# EAGLE design Cartridge_Board_v0.1 (EAGLE 8.3.2)
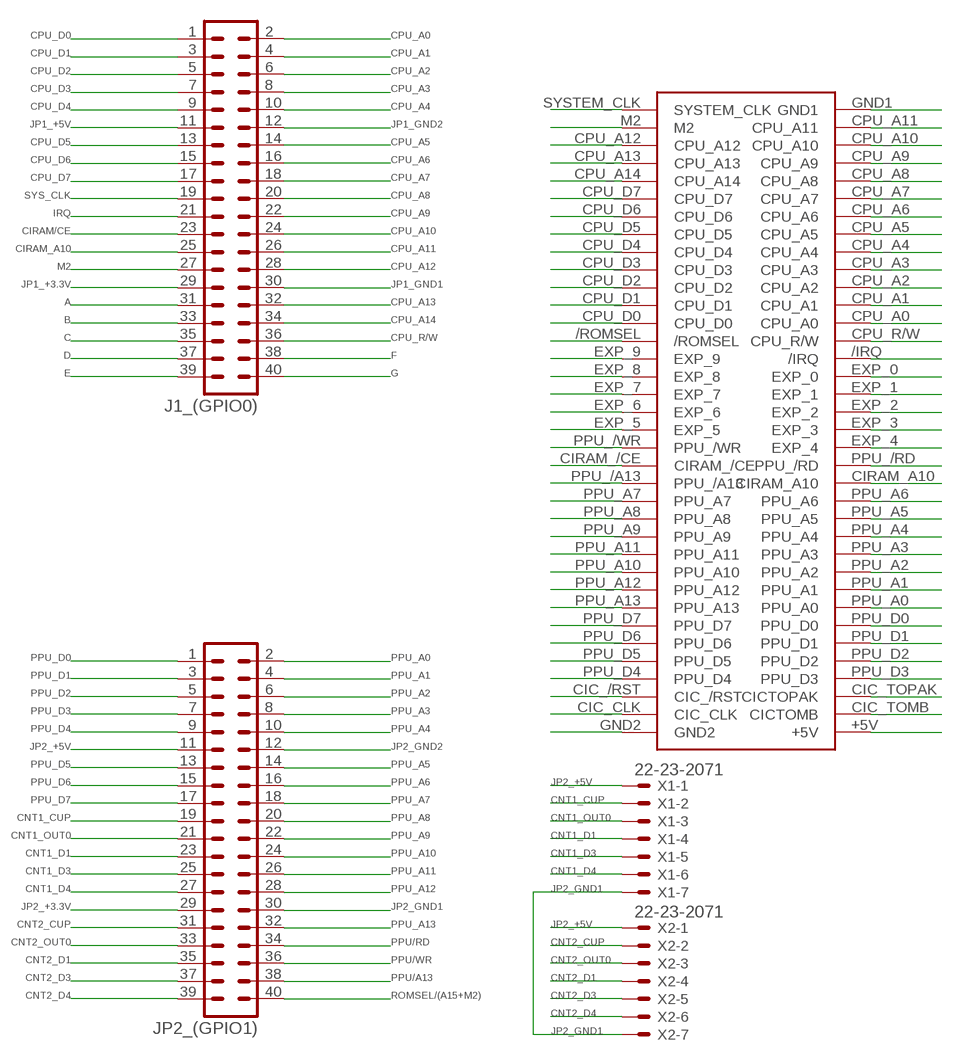
[diagram p0: schematic, sheet 1]

## Parts
J1_(GPIO0)  40V  [40V]
JP2_(GPIO1)  40V  [40V]
U$1  CONNFEMALE72PIN0.1  [36X2]
X1  22-23-2071  [22-23-2071]
X2  22-23-2071  [22-23-2071]

## Nets
A: J1_(GPIO0).31
B: J1_(GPIO0).33
C: J1_(GPIO0).35
CIRAM/CE: J1_(GPIO0).23 U$1.CIRAM_/CE
CIRAM_A10: J1_(GPIO0).25 U$1.CIRAM_A10
CNT1_CUP: JP2_(GPIO1).19 X1.2
CNT1_D1: JP2_(GPIO1).23 X1.4
CNT1_D3: JP2_(GPIO1).25 X1.5
CNT1_D4: JP2_(GPIO1).27 X1.6
CNT1_OUT0: JP2_(GPIO1).21 X1.3
CNT2_CUP: JP2_(GPIO1).31 X2.2
CNT2_D1: JP2_(GPIO1).35 X2.4
CNT2_D3: JP2_(GPIO1).37 X2.5
CNT2_D4: JP2_(GPIO1).39 X2.6
CNT2_OUT0: JP2_(GPIO1).33 X2.3
CPU_A0: J1_(GPIO0).2 U$1.CPU_A0
CPU_A1: J1_(GPIO0).4 U$1.CPU_A1
CPU_A2: J1_(GPIO0).6 U$1.CPU_A2
CPU_A3: J1_(GPIO0).8 U$1.CPU_A3
CPU_A4: J1_(GPIO0).10 U$1.CPU_A4
CPU_A5: J1_(GPIO0).14 U$1.CPU_A5
CPU_A6: J1_(GPIO0).16 U$1.CPU_A6
CPU_A7: J1_(GPIO0).18 U$1.CPU_A7
CPU_A8: J1_(GPIO0).20 U$1.CPU_A8
CPU_A9: J1_(GPIO0).22 U$1.CPU_A9
CPU_A10: J1_(GPIO0).24 U$1.CPU_A10
CPU_A11: J1_(GPIO0).26 U$1.CPU_A11
CPU_A12: J1_(GPIO0).28 U$1.CPU_A12
CPU_A13: J1_(GPIO0).32 U$1.CPU_A13
CPU_A14: J1_(GPIO0).34 U$1.CPU_A14
CPU_D0: J1_(GPIO0).1 U$1.CPU_D0
CPU_D1: J1_(GPIO0).3 U$1.CPU_D1
CPU_D2: J1_(GPIO0).5 U$1.CPU_D2
CPU_D3: J1_(GPIO0).7 U$1.CPU_D3
CPU_D4: J1_(GPIO0).9 U$1.CPU_D4
CPU_D5: J1_(GPIO0).13 U$1.CPU_D5
CPU_D6: J1_(GPIO0).15 U$1.CPU_D6
CPU_D7: J1_(GPIO0).17 U$1.CPU_D7
CPU_R/W: J1_(GPIO0).36 U$1.CPU_R/W
D: J1_(GPIO0).37
E: J1_(GPIO0).39
F: J1_(GPIO0).38
G: J1_(GPIO0).40
IRQ: J1_(GPIO0).21 U$1./IRQ
JP1_+3.3V: J1_(GPIO0).29
JP1_+5V: J1_(GPIO0).11
JP1_GND1: J1_(GPIO0).30 U$1.GND1 U$1.GND2
JP1_GND2: J1_(GPIO0).12
JP2_+3.3V: JP2_(GPIO1).29
JP2_+5V: JP2_(GPIO1).11 U$1.+5V X1.1 X2.1
JP2_GND1: JP2_(GPIO1).30 X1.7 X2.7
JP2_GND2: JP2_(GPIO1).12
M2: J1_(GPIO0).27 U$1.M2
N$27: U$1.EXP_9
N$28: U$1.EXP_8
N$29: U$1.EXP_7
N$30: U$1.EXP_6
N$31: U$1.EXP_5
N$47: U$1.CIC_/RST
N$48: U$1.CIC_CLK
N$65: U$1.EXP_0
N$66: U$1.EXP_1
N$67: U$1.EXP_2
N$68: U$1.EXP_3
N$69: U$1.EXP_4
N$83: U$1.CIC_TOPAK(CICTOPAK)
N$84: U$1.CIC_TOMB(CICTOMB)
PPU/A13: JP2_(GPIO1).38 U$1.PPU_/A13
PPU/RD: JP2_(GPIO1).34 U$1.PPU_/RD
PPU/WR: JP2_(GPIO1).36 U$1.PPU_/WR
PPU_A0: JP2_(GPIO1).2 U$1.PPU_A0
PPU_A1: JP2_(GPIO1).4 U$1.PPU_A1
PPU_A2: JP2_(GPIO1).6 U$1.PPU_A2
PPU_A3: JP2_(GPIO1).8 U$1.PPU_A3
PPU_A4: JP2_(GPIO1).10 U$1.PPU_A4
PPU_A5: JP2_(GPIO1).14 U$1.PPU_A5
PPU_A6: JP2_(GPIO1).16 U$1.PPU_A6
PPU_A7: JP2_(GPIO1).18 U$1.PPU_A7
PPU_A8: JP2_(GPIO1).20 U$1.PPU_A8
PPU_A9: JP2_(GPIO1).22 U$1.PPU_A9
PPU_A10: JP2_(GPIO1).24 U$1.PPU_A10
PPU_A11: JP2_(GPIO1).26 U$1.PPU_A11
PPU_A12: JP2_(GPIO1).28 U$1.PPU_A12
PPU_A13: JP2_(GPIO1).32 U$1.PPU_A13
PPU_D0: JP2_(GPIO1).1 U$1.PPU_D0
PPU_D1: JP2_(GPIO1).3 U$1.PPU_D1
PPU_D2: JP2_(GPIO1).5 U$1.PPU_D2
PPU_D3: JP2_(GPIO1).7 U$1.PPU_D3
PPU_D4: JP2_(GPIO1).9 U$1.PPU_D4
PPU_D5: JP2_(GPIO1).13 U$1.PPU_D5
PPU_D6: JP2_(GPIO1).15 U$1.PPU_D6
PPU_D7: JP2_(GPIO1).17 U$1.PPU_D7
ROMSEL/(A15+M2): JP2_(GPIO1).40 U$1./ROMSEL
SYS_CLK: J1_(GPIO0).19 U$1.SYSTEM_CLK

## Library data of the parts
J1_(GPIO0) JP2_(GPIO1) = con-harting-v:40V: CONNECTOR; OC_FARNELL: unknown; OC_NEWARK: unknown
U$1 = NES:CONNFEMALE72PIN0.1
X1 X2 = con-molex:22-23-2071: .100" (2.54mm) Center Header - 7 Pin; MF: MOLEX; MPN: 22-23-2071; OC_FARNELL: 1654534; OC_NEWARK: 56H0445

## Board
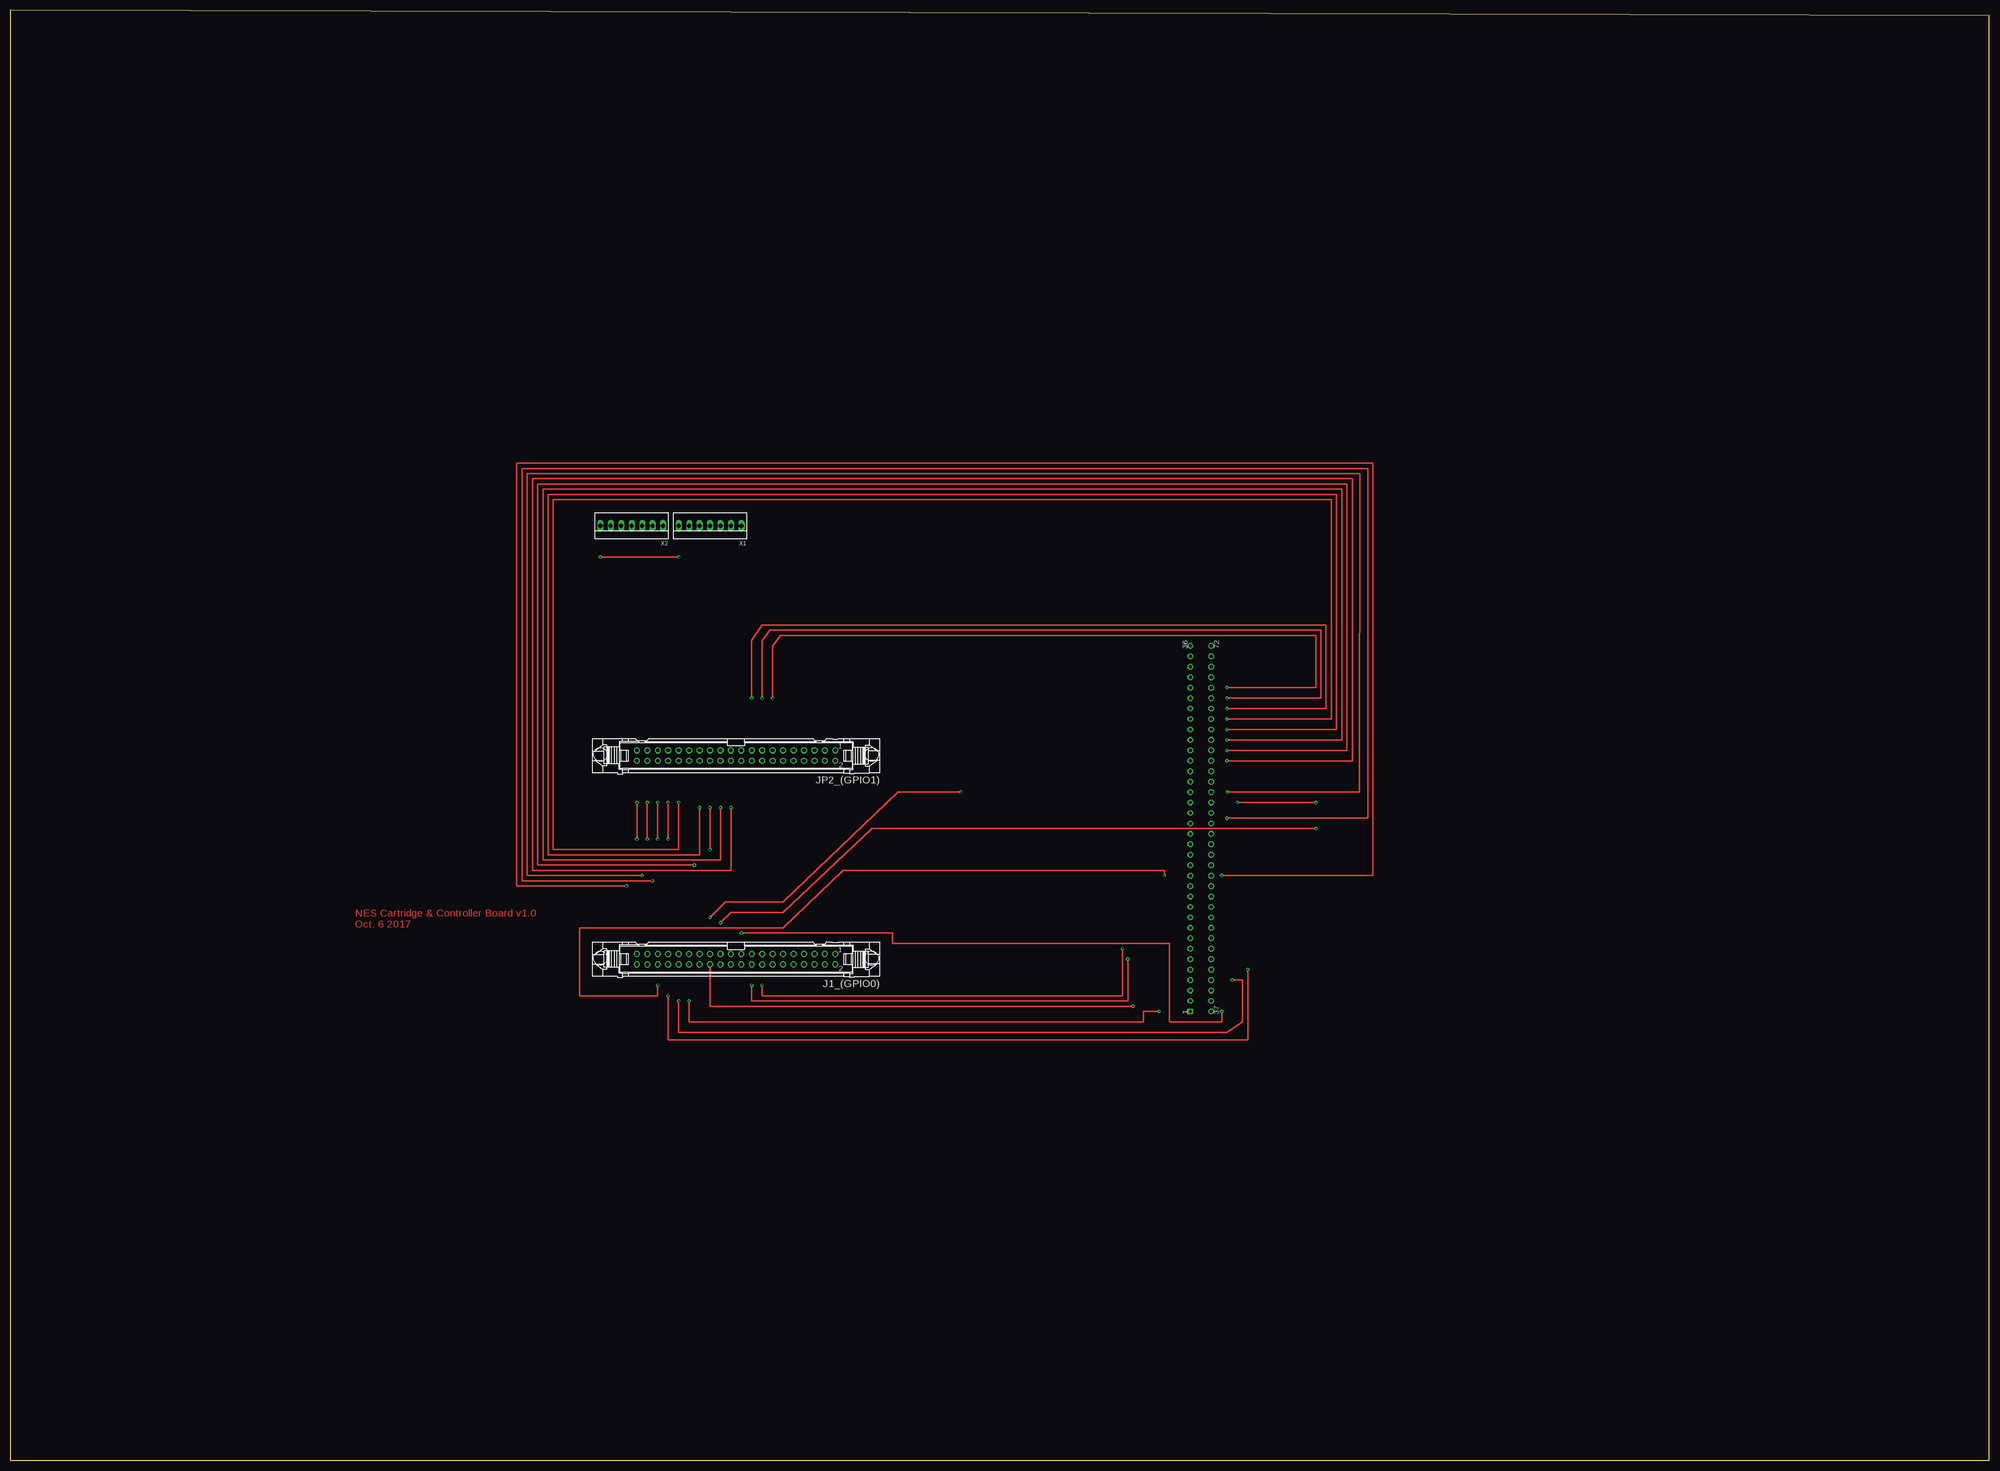
[diagram p1: board, top side]
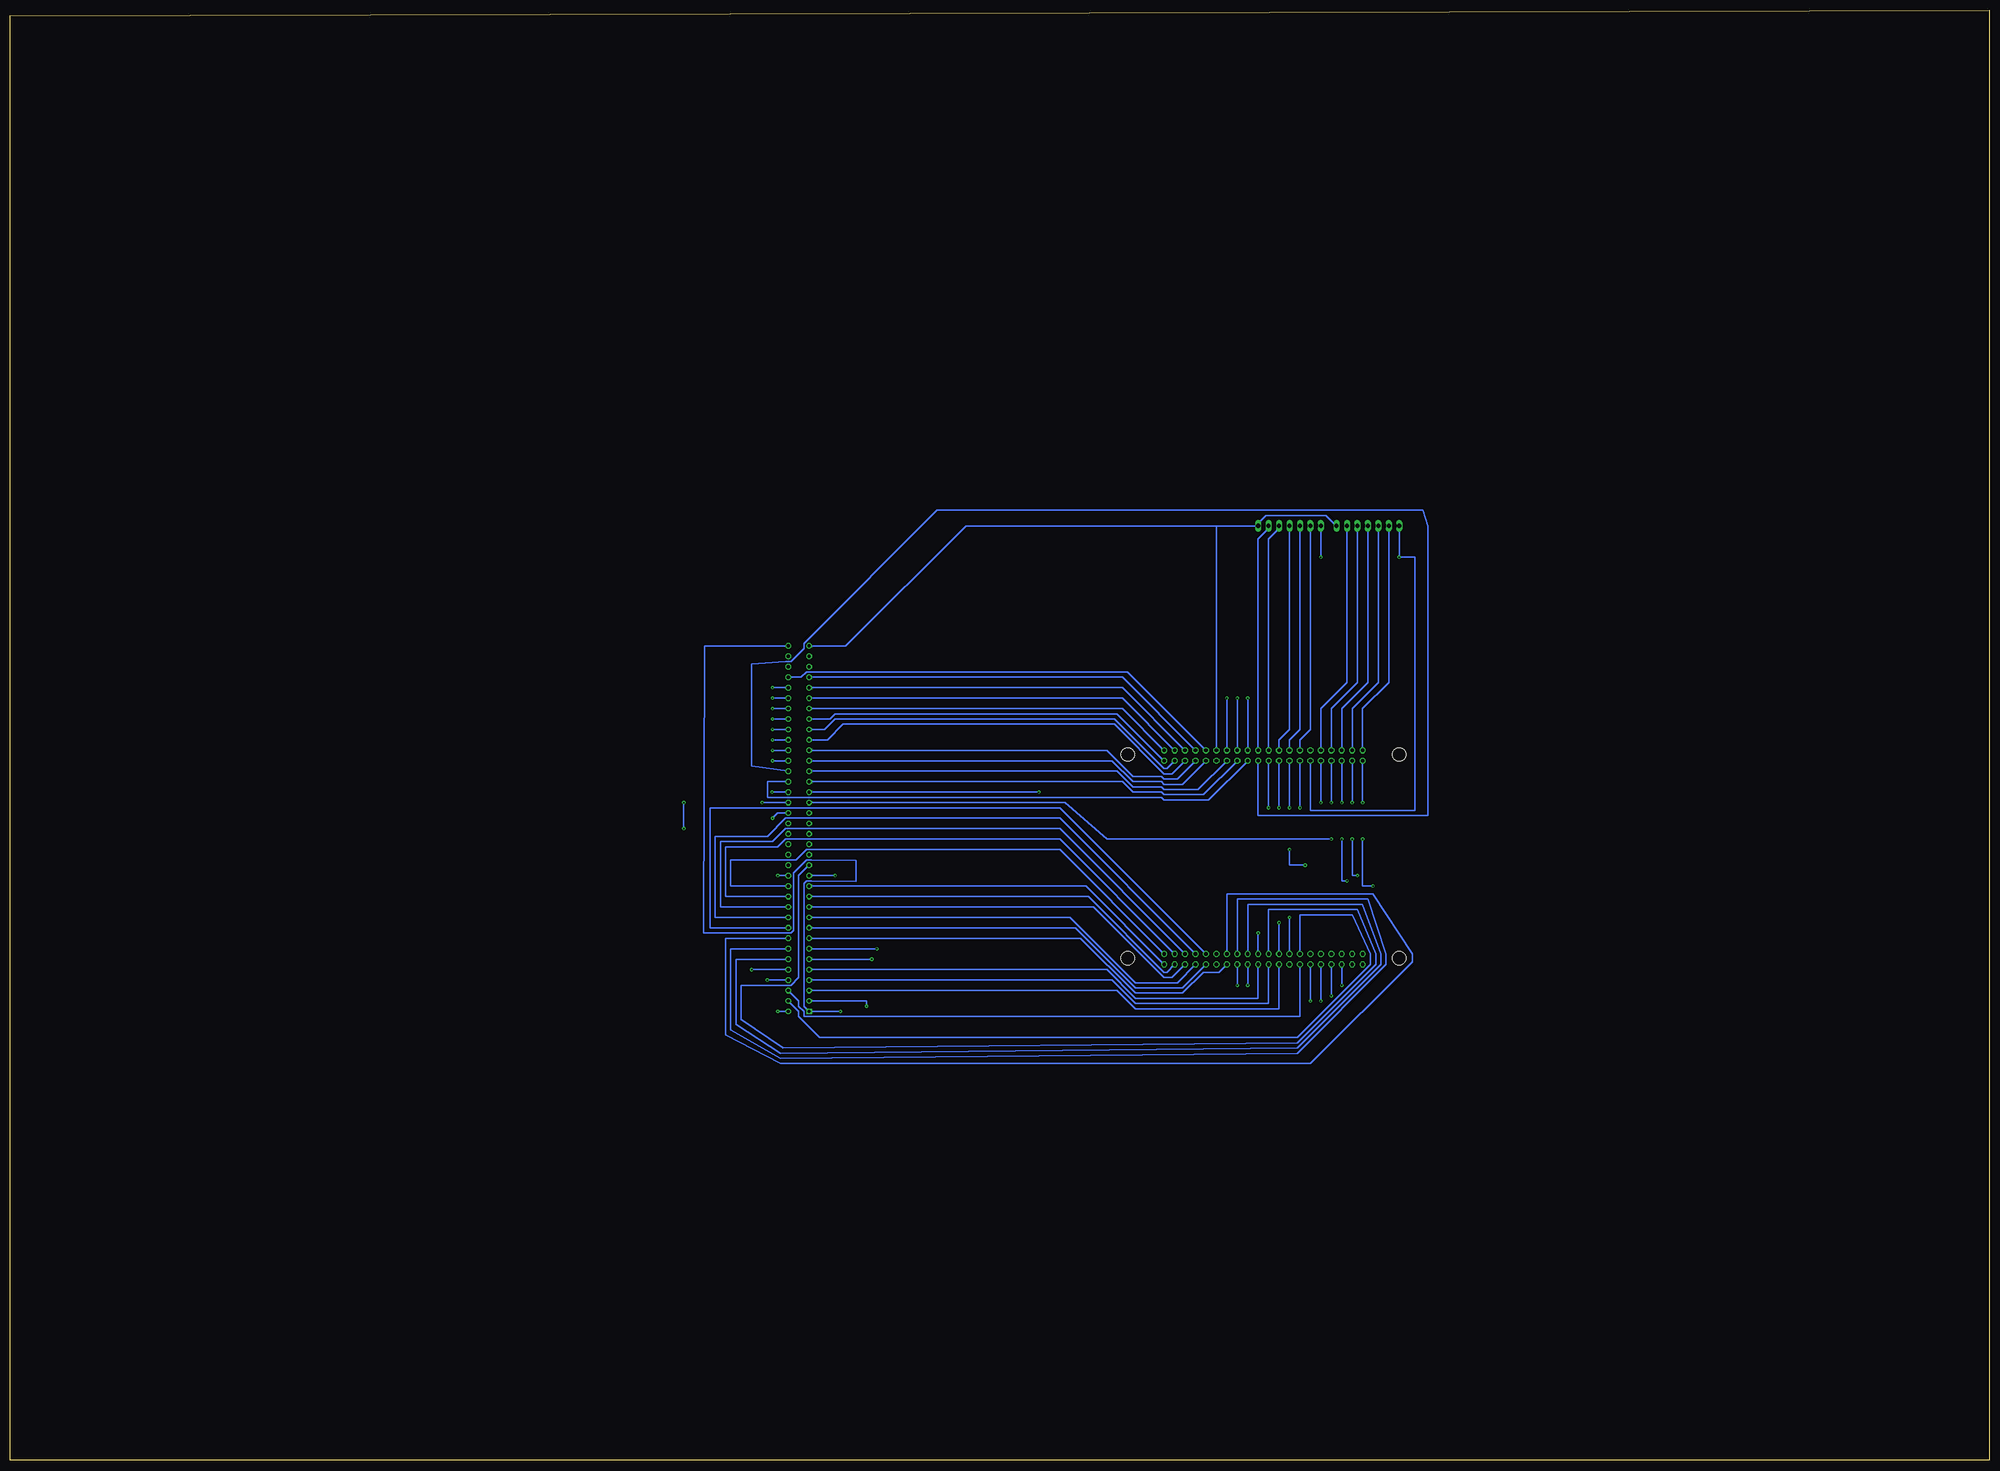
[diagram p2: board, bottom side, seen from below]

Size 481.31 x 352.73 mm. Coordinates in mm from the lower left corner, seen from the top.
Outline: 0,0 481.31,0 481.31,351.46 0,352.73 0,0
Copper layers (1*16): Top 0.035mm / dielectric 1.5mm / Bottom 0.035mm
Design rules "default *": minimum track width 16mil, minimum drill 0.35mm, track to track 16mil, track to pad 16mil, pad to pad 16mil, via to via 16mil, smd to smd 16mil, copper to edge 40mil, drill to drill 6mil, minimum pad ring 10mil, minimum via ring 8mil, stop-mask expansion 4mil, vias tented up to drill 0mil, thermal gap 10mil

### Footprints (pad centres in the part's own frame; a part is rotated, then mirrored left to right if it is on the bottom)
40V = drill 0.914: 1 -24.13,-1.27 | drill 0.914 octagon: 2 -24.13,1.27; 3 -21.59,-1.27; 4 -21.59,1.27; 5 -19.05,-1.27; 6 -19.05,1.27; 7 -16.51,-1.27; 8 -16.51,1.27; 9 -13.97,-1.27; 10 -13.97,1.27; 11 -11.43,-1.27; 12 -11.43,1.27; 13 -8.89,-1.27; 14 -8.89,1.27; 15 -6.35,-1.27; 16 -6.35,1.27; 17 -3.81,-1.27; 18 -3.81,1.27; 19 -1.27,-1.27; 20 -1.27,1.27; 21 1.27,-1.27; 22 1.27,1.27; 23 3.81,-1.27; 24 3.81,1.27; 25 6.35,-1.27; 26 6.35,1.27; 27 8.89,-1.27; 28 8.89,1.27; 29 11.43,-1.27; 30 11.43,1.27; 31 13.97,-1.27; 32 13.97,1.27; 33 16.51,-1.27; 34 16.51,1.27; 35 19.05,-1.27; 36 19.05,1.27; 37 21.59,-1.27; 38 21.59,1.27; 39 24.13,-1.27; 40 24.13,1.27 | hole 3.302: 33.02,-0.254; -33.02,-0.254
36X2 = drill 0.8 octagon: +5V 44.45,2.54; /IRQ -8.89,2.54; /ROMSEL -11.43,-2.54; CIC_/RST 39.37,-2.54; CIC_CLK 41.91,-2.54; CIC_TOMB 41.91,2.54; CIC_TOPAK 39.37,2.54; CIRAM_/CE 6.35,-2.54; CIRAM_A10 8.89,2.54; CPU_A0 -13.97,2.54; CPU_A1 -16.51,2.54; CPU_A2 -19.05,2.54; CPU_A3 -21.59,2.54; CPU_A4 -24.13,2.54; CPU_A5 -26.67,2.54; CPU_A6 -29.21,2.54; CPU_A7 -31.75,2.54; CPU_A8 -34.29,2.54; CPU_A9 -36.83,2.54; CPU_A10 -39.37,2.54; CPU_A11 -41.91,2.54; CPU_A12 -39.37,-2.54; CPU_A13 -36.83,-2.54; CPU_A14 -34.29,-2.54; CPU_D0 -13.97,-2.54; CPU_D1 -16.51,-2.54; CPU_D2 -19.05,-2.54; CPU_D3 -21.59,-2.54; CPU_D4 -24.13,-2.54; CPU_D5 -26.67,-2.54; CPU_D6 -29.21,-2.54; CPU_D7 -31.75,-2.54; CPU_R/W -11.43,2.54; EXP_0 -6.35,2.54; EXP_1 -3.81,2.54; EXP_2 -1.27,2.54; EXP_3 1.27,2.54; EXP_4 3.81,2.54; EXP_5 1.27,-2.54; EXP_6 -1.27,-2.54; EXP_7 -3.81,-2.54; EXP_8 -6.35,-2.54; EXP_9 -8.89,-2.54; GND2 44.45,-2.54; M2 -41.91,-2.54; PPU_/A13 8.89,-2.54; PPU_/RD 6.35,2.54; PPU_/WR 3.81,-2.54; PPU_A0 26.67,2.54; PPU_A1 24.13,2.54; PPU_A2 21.59,2.54; PPU_A3 19.05,2.54; PPU_A4 16.51,2.54; PPU_A5 13.97,2.54; PPU_A6 11.43,2.54; PPU_A7 11.43,-2.54; PPU_A8 13.97,-2.54; PPU_A9 16.51,-2.54; PPU_A10 21.59,-2.54; PPU_A11 19.05,-2.54; PPU_A12 24.13,-2.54; PPU_A13 26.67,-2.54; PPU_D0 29.21,2.54; PPU_D1 31.75,2.54; PPU_D2 34.29,2.54; PPU_D3 36.83,2.54; PPU_D4 36.83,-2.54; PPU_D5 34.29,-2.54; PPU_D6 31.75,-2.54; PPU_D7 29.21,-2.54; SYSTEM_CLK -44.45,-2.54 | drill 0.8 square: GND1 -44.45,2.54
22-23-2071 = drill 1 long: 1 -7.62,0; 2 -5.08,0; 3 -2.54,0; 4 0,0; 5 2.54,0; 6 5.08,0; 7 7.62,0

### Placement (x,y rotation side)
DRILEGEND  [DRILEGEND]  0,-3.81 0 top  (outside the outline)
J1_(GPIO0)  176.53,121.92 180 top
JP2_(GPIO1)  176.53,171.45 180 top
U$1  289.56,153.67 90 top
X1  170.18,227.33 180 top
X2  151.13,227.33 180 top

### Tracks (layer width: path | path; a pad name or v marks a point on that pad's centre or on a via)
CIRAM/CE  (via drill 0.35)
  Top 0.406: v298.45,160.02 v317.5,160.02 | v317.5,153.67 209.55,153.67 187.96,133.35 175.26,133.35 v172.72,130.81
  Bottom 0.406: U$1.CIRAM_/CE v298.45,160.02 | v317.5,160.02 v317.5,153.67 | v172.72,130.81 J1_(GPIO0).23
CIRAM_A10  (via drill 0.35)
  Top 0.406: v231.14,162.56 215.9,162.56 187.96,135.89 173.99,135.89 v170.18,132.08
  Bottom 0.406: U$1.CIRAM_A10 v231.14,162.56 | v170.18,132.08 J1_(GPIO0).25
CNT1_CUP
  Bottom 0.406: JP2_(GPIO1).19 177.8,224.15 175.26,226.69 X1.2
CNT1_D1
  Bottom 0.406: JP2_(GPIO1).23 172.72,175.26 170.18,177.8 X1.4
CNT1_D3
  Bottom 0.406: JP2_(GPIO1).25 170.18,175.26 167.64,177.8 X1.5
CNT1_D4
  Bottom 0.406: JP2_(GPIO1).27 167.64,175.26 165.1,177.8 X1.6
CNT1_OUT0
  Bottom 0.406: JP2_(GPIO1).21 175.26,224.15 172.72,226.69 X1.3
CNT2_CUP
  Bottom 0.406: X2.2 156.21,189.23 162.56,182.88 JP2_(GPIO1).31
CNT2_D1
  Bottom 0.406: X2.4 151.13,189.23 157.48,182.88 JP2_(GPIO1).35
CNT2_D3
  Bottom 0.406: X2.5 148.59,189.23 154.94,182.88 JP2_(GPIO1).37
CNT2_D4
  Bottom 0.406: X2.6 146.05,189.23 152.4,182.88 JP2_(GPIO1).39
CNT2_OUT0
  Bottom 0.406: X2.3 153.67,189.23 160.02,182.88 JP2_(GPIO1).33
CPU_A0
  Bottom 0.406: U$1.CPU_A0 219.71,139.7 J1_(GPIO0).2
CPU_A1
  Bottom 0.406: U$1.CPU_A1 219.07,137.16 200.66,118.74 200.03,118.74 J1_(GPIO0).4
CPU_A2
  Bottom 0.406: U$1.CPU_A2 217.81,134.62 200.66,117.47 198.75,117.47 J1_(GPIO0).6
CPU_A3
  Bottom 0.406: U$1.CPU_A3 223.52,132.08 207.64,116.2 197.49,116.2 J1_(GPIO0).8
CPU_A4
  Bottom 0.406: U$1.CPU_A4 222.25,129.54 207.64,114.93 196.22,114.93 J1_(GPIO0).10
CPU_A5
  Bottom 0.406: U$1.CPU_A5 220.98,127 207.64,113.66 196.22,113.66 191.13,118.74 187.32,118.74 J1_(GPIO0).14
CPU_A6  (via drill 0.35)
  Top 0.406: v182.88,115.57 182.88,113.03 270.51,113.03 v270.51,124.46
  Bottom 0.406: U$1.CPU_A6 v270.51,124.46 | v182.88,115.57 J1_(GPIO0).16
CPU_A7  (via drill 0.35)
  Top 0.406: v180.34,115.57 180.34,111.76 271.78,111.76 v271.78,121.92
  Bottom 0.406: U$1.CPU_A7 v271.78,121.92 | v180.34,115.57 J1_(GPIO0).18
CPU_A8
  Bottom 0.406: U$1.CPU_A8 214.63,119.38 207.64,112.39 177.8,112.39 J1_(GPIO0).20
CPU_A9
  Bottom 0.406: U$1.CPU_A9 213.36,116.84 207.64,111.12 175.26,111.12 J1_(GPIO0).22
CPU_A10
  Bottom 0.406: U$1.CPU_A10 212.09,114.3 207.64,109.85 172.72,109.85 J1_(GPIO0).24
CPU_A11  (via drill 0.35)
  Top 0.406: J1_(GPIO0).26 170.18,110.49 v273.05,110.49
  Bottom 0.406: U$1.CPU_A11 273.05,111.76 v273.05,110.49
CPU_A12
  Bottom 0.406: U$1.CPU_A12 289.56,111.76 289.56,110.49 288.29,109.22 288.29,107.95 167.64,107.95 J1_(GPIO0).28
CPU_A13  (via drill 0.35)
  Top 0.406: v297.18,116.84 299.72,116.84 299.72,106.68 295.91,104.14 162.56,104.14 v162.56,111.76
  Bottom 0.406: U$1.CPU_A13 v297.18,116.84 | v162.56,111.76 J1_(GPIO0).32
CPU_A14  (via drill 0.35)
  Top 0.406: v300.99,119.38 300.99,102.23 160.02,102.23 v160.02,113.03
  Bottom 0.406: U$1.CPU_A14 v300.99,119.38 | v160.02,113.03 J1_(GPIO0).34
CPU_D0
  Bottom 0.406: U$1.CPU_D0 306.07,139.7 306.07,146.05 290.19,146.05 287.65,148.59 226.06,148.59 J1_(GPIO0).1
CPU_D1
  Bottom 0.406: U$1.CPU_D1 307.34,137.16 307.34,149.22 294.64,149.22 292.74,151.13 226.06,151.13 J1_(GPIO0).3
CPU_D2
  Bottom 0.406: U$1.CPU_D2 308.61,134.62 308.61,150.49 295.91,150.49 292.74,153.67 226.06,153.67 J1_(GPIO0).5
CPU_D3
  Bottom 0.406: U$1.CPU_D3 309.88,132.08 309.88,151.76 297.18,151.76 292.74,156.21 226.06,156.21 J1_(GPIO0).7
CPU_D4
  Bottom 0.406: U$1.CPU_D4 311.15,129.54 311.15,158.75 226.06,158.75 J1_(GPIO0).9
CPU_D5
  Bottom 0.406: U$1.CPU_D5 307.34,127 307.34,103.5 294,96.52 165.1,96.52 140.34,121.28 140.34,123.19 149.86,137.79 185.42,137.79 J1_(GPIO0).13
CPU_D6
  Bottom 0.406: U$1.CPU_D6 306.07,124.46 306.07,104.77 294,97.79 168.28,99.06 146.69,120.65 146.69,123.19 151.13,136.52 182.88,136.52 J1_(GPIO0).15
CPU_D7
  Bottom 0.406: U$1.CPU_D7 304.8,121.92 304.8,106.04 294,99.06 168.28,100.33 147.95,120.65 147.95,123.19 152.4,135.25 180.34,135.25 J1_(GPIO0).17
CPU_R/W  (via drill 0.35)
  Top 0.406: v280.67,142.24 280.67,143.51 202.56,143.51 187.96,129.54 138.43,129.54 138.43,113.03 157.48,113.03 v157.48,115.57
  Bottom 0.406: U$1.CPU_R/W v280.67,142.24 | v157.48,115.57 J1_(GPIO0).36
IRQ
  Bottom 0.406: U$1./IRQ 289.56,142.24 289.56,117.47 291.47,115.57 303.53,115.57 303.53,107.31 293.37,100.33 168.28,101.6 149.22,120.65 149.22,123.19 153.67,133.98 175.26,133.98 J1_(GPIO0).21
JP1_GND1  (via drill 0.35)
  Top 0.406: v279.4,109.22 275.59,109.22 275.59,106.68 165.1,106.68 v165.1,111.76
  Bottom 0.406: U$1.GND2 312.42,198.12 312.67,128.27 291.47,128.27 290.83,128.9 290.83,142.88 287.65,146.05 286.38,146.05 275.59,145.92 275.59,140.84 286.38,140.97 287.65,140.97 288.29,140.33 288.29,110.49 U$1.GND1 v279.4,109.22 | v165.1,111.76 J1_(GPIO0).30
JP2_+5V
  Bottom 0.406: U$1.+5V 278.13,198.12 248.92,227.33 187.96,227.33 | 178.44,227.33 187.96,227.33 | 187.96,227.33 JP2_(GPIO1).11 | X2.1 161.29,229.87 175.9,229.87 178.44,227.33 | 178.44,227.33 X1.1
JP2_GND1  (via drill 0.4)
  Top 0.406: v143.51,219.71 v162.56,219.71
  Bottom 0.406: JP2_(GPIO1).30 165.1,158.11 139.7,158.11 139.7,219.71 v143.51,219.71 X2.7 | v162.56,219.71 X1.7
M2
  Bottom 0.406: U$1.M2 289.56,109.22 289.56,107.95 284.48,102.87 168.28,102.87 150.5,120.65 150.5,123.19 154.94,132.71 167.64,132.71 J1_(GPIO0).27
PPU/A13  (via drill 0.35)
  Top 0.406: v153.67,142.24 125.73,142.24 125.73,240.03 328.29,240.03 328.17,162.56 v296.04,162.56 | v154.94,151.13 v154.94,160.02
  Bottom 0.406: U$1.PPU_/A13 v296.04,162.56 | v153.67,142.24 154.94,142.24 v154.94,151.13 | v154.94,160.02 JP2_(GPIO1).38
PPU/RD  (via drill 0.35)
  Top 0.406: v160.02,151.13 v160.02,160.02
  Bottom 0.406: U$1.PPU_/RD 224.79,160.02 214.63,151.13 v160.02,151.13 | v160.02,160.02 JP2_(GPIO1).34
PPU/WR  (via drill 0.35)
  Top 0.406: v156.21,140.97 124.46,140.97 124.46,241.3 330.2,241.3 330.2,156.21 v295.91,156.21 | v157.48,151.13 v157.48,160.02
  Bottom 0.406: U$1.PPU_/WR 294.64,157.48 v295.91,156.21 | v156.21,140.97 157.48,140.97 v157.48,151.13 | v157.48,160.02 JP2_(GPIO1).36
PPU_A0
  Bottom 0.406: U$1.PPU_A0 281.94,180.34 280.67,181.61 212.09,181.61 JP2_(GPIO1).2
PPU_A1
  Bottom 0.406: U$1.PPU_A1 283.21,177.8 280.67,180.34 212.72,180.34 200.66,168.27 200.03,168.27 JP2_(GPIO1).4
PPU_A2
  Bottom 0.406: U$1.PPU_A2 282.57,175.26 278.76,179.07 212.72,179.07 200.66,167 198.75,167 JP2_(GPIO1).6
PPU_A3
  Bottom 0.406: U$1.PPU_A3 214.63,172.72 208.28,166.37 201.29,166.37 200.66,165.73 197.49,165.73 JP2_(GPIO1).8
PPU_A4
  Bottom 0.406: U$1.PPU_A4 213.36,170.18 208.28,165.1 201.29,165.1 200.66,164.46 196.22,164.46 JP2_(GPIO1).10
PPU_A5
  Bottom 0.406: U$1.PPU_A5 212.09,167.64 208.28,163.83 201.29,163.83 200.66,163.19 192.41,163.19 JP2_(GPIO1).14
PPU_A6
  Bottom 0.406: U$1.PPU_A6 210.82,165.1 208.28,162.56 201.29,162.56 200.66,161.92 191.13,161.92 JP2_(GPIO1).16
PPU_A7
  Bottom 0.406: U$1.PPU_A7 297.18,165.1 297.18,161.29 201.29,161.29 200.66,160.66 189.87,160.66 JP2_(GPIO1).18
PPU_A8
  Bottom 0.406: U$1.PPU_A8 300.99,168.91 300.99,193.67 292.74,194.31 291.47,194.31 288.29,197.48 288.29,198.75 255.91,231.14 137.8,231.14 136.53,227.33 136.53,156.84 177.8,156.84 JP2_(GPIO1).20
PPU_A9  (via drill 0.35)
  Top 0.406: v295.91,170.18 326.39,170.18 326.39,238.76 127,238.76 127,143.51 175.26,143.51 v175.26,158.75
  Bottom 0.406: U$1.PPU_A9 v295.91,170.18 | v175.26,158.75 JP2_(GPIO1).22
PPU_A10  (via drill 0.35)
  Top 0.406: v295.91,175.26 323.85,175.26 323.85,236.22 129.54,236.22 129.54,146.05 172.72,146.05 v172.72,158.75
  Bottom 0.406: U$1.PPU_A10 v295.91,175.26 | v172.72,158.75 JP2_(GPIO1).24
PPU_A11  (via drill 0.35)
  Top 0.406: v166.37,144.78 128.27,144.78 128.27,237.49 325.12,237.49 325.12,172.72 v295.91,172.72 | v170.18,148.59 v170.18,158.75
  Bottom 0.406: U$1.PPU_A11 v295.91,172.72 | v166.37,144.78 170.18,144.78 v170.18,148.59 | v170.18,158.75 JP2_(GPIO1).26
PPU_A12  (via drill 0.35)
  Top 0.406: v295.91,177.8 322.58,177.8 322.58,234.95 130.81,234.95 130.81,147.32 167.64,147.32 v167.64,158.75
  Bottom 0.406: U$1.PPU_A12 v295.91,177.8 | v167.64,158.75 JP2_(GPIO1).28
PPU_A13  (via drill 0.35)
  Top 0.406: v295.91,180.34 321.31,180.34 321.31,233.68 132.08,233.68 132.08,148.59 162.56,148.59 v162.56,160.02
  Bottom 0.406: U$1.PPU_A13 v295.91,180.34 | v162.56,160.02 JP2_(GPIO1).32
PPU_D0
  Bottom 0.406: U$1.PPU_D0 210.82,182.88 JP2_(GPIO1).1
PPU_D1
  Bottom 0.406: U$1.PPU_D1 210.82,185.42 JP2_(GPIO1).3
PPU_D2
  Bottom 0.406: U$1.PPU_D2 210.82,187.96 JP2_(GPIO1).5
PPU_D3
  Bottom 0.406: U$1.PPU_D3 210.82,190.5 JP2_(GPIO1).7
PPU_D4
  Bottom 0.406: U$1.PPU_D4 288.93,190.5 287.65,191.77 209.55,191.77 JP2_(GPIO1).9
PPU_D5  (via drill 0.35)
  Top 0.406: v295.91,187.96 317.5,187.96 317.5,200.66 187.32,200.66 185.42,198.12 v185.42,185.42
  Bottom 0.406: U$1.PPU_D5 v295.91,187.96 | v185.42,185.42 JP2_(GPIO1).13
PPU_D6  (via drill 0.35)
  Top 0.406: v295.91,185.42 318.77,185.42 318.77,201.93 184.78,201.93 182.88,199.39 v182.88,185.42
  Bottom 0.406: U$1.PPU_D6 v295.91,185.42 | v182.88,185.42 JP2_(GPIO1).15
PPU_D7  (via drill 0.35)
  Top 0.406: v180.34,185.42 180.34,199.39 182.88,203.2 320.04,203.2 320.04,182.88 v295.91,182.88
  Bottom 0.406: U$1.PPU_D7 v295.91,182.88 | v180.34,185.42 JP2_(GPIO1).17
ROMSEL/(A15+M2)  (via drill 0.35)
  Top 0.406: v149.86,139.7 123.19,139.7 123.19,242.57 331.47,242.57 331.47,142.24 v294.64,142.24 | v152.4,151.13 v152.4,160.02
  Bottom 0.406: U$1./ROMSEL v294.64,142.24 | v149.86,139.7 152.4,139.7 v152.4,151.13 | v152.4,160.02 JP2_(GPIO1).40
SYS_CLK  (via drill 0.35)
  Top 0.406: v294.64,109.22 294.64,106.68 281.94,106.68 281.94,125.73 214.63,125.73 214.63,128.27 v177.8,128.27
  Bottom 0.406: U$1.SYSTEM_CLK v294.64,109.22 | v177.8,128.27 J1_(GPIO0).19

### Text on the board
Top: NES Cartridge & Controller Board v1.0 / Oct. 6 2017